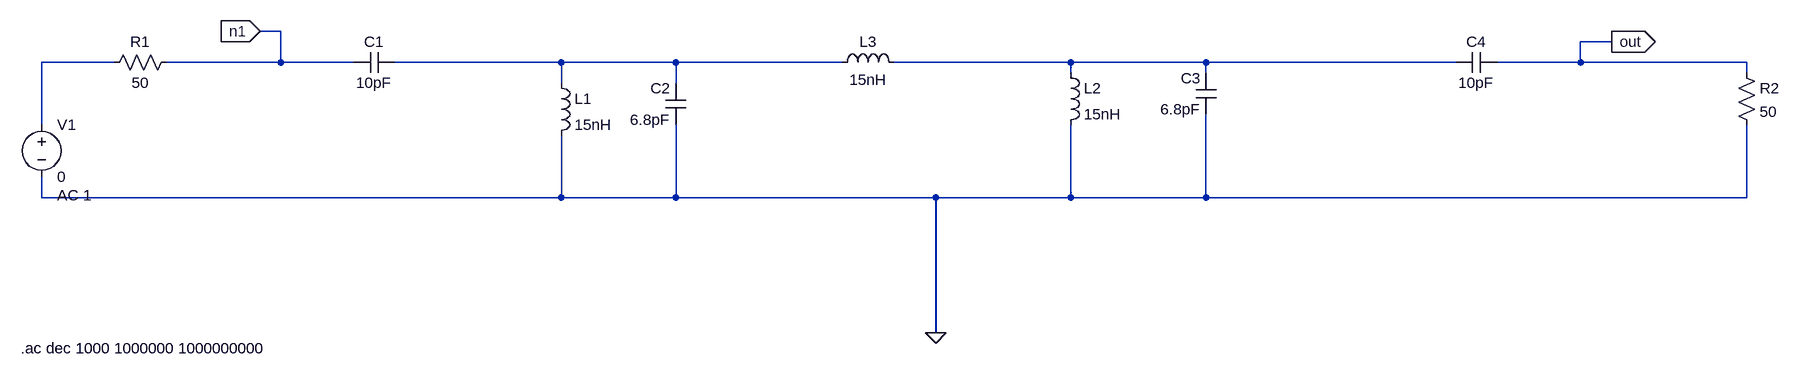
[diagram p0: schematic 538MHz_BPF_v01.asc]
538MHz_BPF_v01.asc, the LTspice schematic file:
Version 4.1
SHEET 1 2520 680
WIRE 208 -16 176 -16
WIRE 2256 0 2208 0
WIRE -48 32 -160 32
WIRE 208 32 208 -16
WIRE 208 32 32 32
WIRE 320 32 208 32
WIRE 640 32 384 32
WIRE 816 32 640 32
WIRE 1072 32 816 32
WIRE 1424 32 1152 32
WIRE 1632 32 1424 32
WIRE 2016 32 1632 32
WIRE 2208 32 2208 0
WIRE 2208 32 2080 32
WIRE 2464 32 2208 32
WIRE 1424 48 1424 32
WIRE 1632 48 1632 32
WIRE 2464 48 2464 32
WIRE 640 64 640 32
WIRE 816 64 816 32
WIRE -160 128 -160 32
WIRE -160 240 -160 208
WIRE 640 240 640 144
WIRE 640 240 -160 240
WIRE 816 240 816 128
WIRE 816 240 640 240
WIRE 1216 240 816 240
WIRE 1424 240 1424 128
WIRE 1424 240 1216 240
WIRE 1632 240 1632 112
WIRE 1632 240 1424 240
WIRE 2464 240 2464 128
WIRE 2464 240 1632 240
WIRE 1216 448 1216 240
FLAG 1216 448 0
FLAG 176 -16 n1
IOPIN 176 -16 In
FLAG 2256 0 out
IOPIN 2256 0 Out
SYMBOL voltage -160 112 R0
WINDOW 123 24 124 Left 2
WINDOW 39 0 0 Left 0
SYMATTR InstName V1
SYMATTR Value 0
SYMATTR Value2 AC 1
SYMBOL res 48 16 R90
WINDOW 0 0 56 VBottom 2
WINDOW 3 32 56 VTop 2
SYMATTR InstName R1
SYMATTR Value 50
SYMBOL cap 384 16 R90
WINDOW 0 0 32 VBottom 2
WINDOW 3 32 32 VTop 2
SYMATTR InstName C1
SYMATTR Value 10pF
SYMBOL cap 832 128 R180
WINDOW 0 24 56 Left 2
WINDOW 3 24 8 Left 2
SYMATTR InstName C2
SYMATTR Value 6.8pF
SYMBOL cap 1648 112 R180
WINDOW 0 24 56 Left 2
WINDOW 3 24 8 Left 2
SYMATTR InstName C3
SYMATTR Value 6.8pF
SYMBOL cap 2016 48 R270
WINDOW 0 32 32 VTop 2
WINDOW 3 0 32 VBottom 2
SYMATTR InstName C4
SYMATTR Value 10pF
SYMBOL res 2448 32 R0
SYMATTR InstName R2
SYMATTR Value 50
SYMBOL ind 624 48 R0
SYMATTR InstName L1
SYMATTR Value 15nH
SYMBOL ind 1408 32 R0
SYMATTR InstName L2
SYMATTR Value 15nH
SYMBOL ind 1056 48 R270
WINDOW 0 32 56 VTop 2
WINDOW 3 5 56 VBottom 2
SYMATTR InstName L3
SYMATTR Value 15nH
TEXT -192 472 Left 2 !.ac dec 1000 1000000 1000000000

The netlist it stands for:
* 538MHz_BPF_v01.asc
V1 N001 0 0 AC 1
R1 n1 N001 50
C1 N002 n1 10pF
C2 0 N002 6.8pF
C3 0 N003 6.8pF
C4 N003 out 10pF
R2 out 0 50
L1 N002 0 15nH
L2 N003 0 15nH
L3 N002 N003 15nH
.ac dec 1000 1000000 1000000000
.backanno
.end